# EAGLE design cuk_inverter (EAGLE 8.2.2)
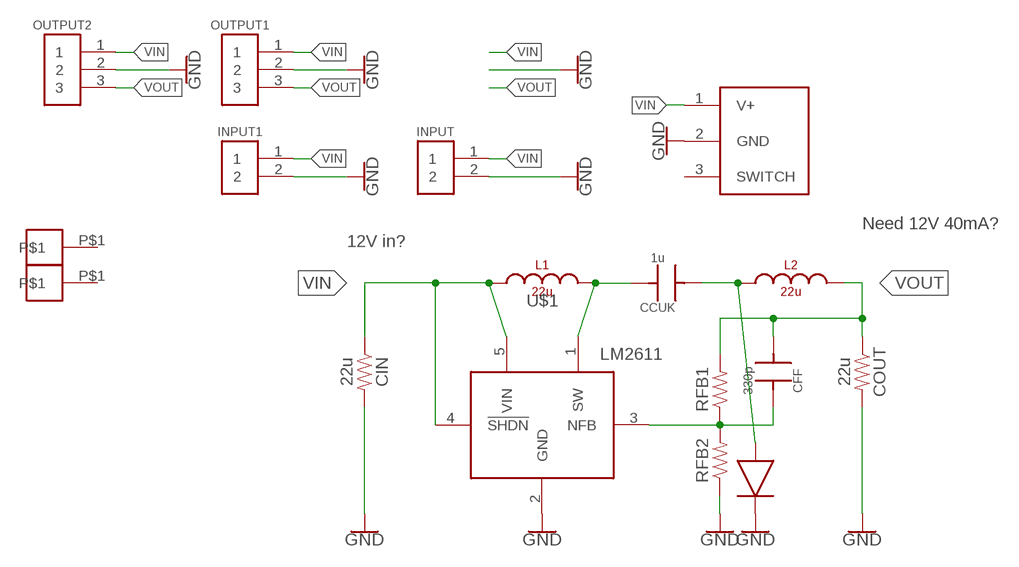
[diagram p0: schematic, sheet 1]

## Parts
CCUK  1u  CAP805B  [0805_B]
CFF  330p  CAP805B  [0805_B]
CIN  22u  RESISTOR1206  [1206]
COUT  22u  RESISTOR1206  [1206]
INPUT  M02  [OSTVN02]
INPUT1  M02  [OSTVN02]
L1  22u  INDUCTORSRU5018  [INDUCTOR_BOURNS_SRU5018]
L2  22u  INDUCTORSRU5018  [INDUCTOR_BOURNS_SRU5018]
OUTPUT1  M03  [OSTVN03]
OUTPUT2  M03  [OSTVN03]
RFB1  RESISTOR0805  [0805]
RFB2  RESISTOR0805  [0805]
U$1  LM2611  [SOT-23]
U$6  FIDUCIAL  [FIDUCIAL_0.5MM]
U$7  FIDUCIAL  [FIDUCIAL_0.5MM]
U$8  DIODE  [STTH3R04U]
V1  POWER_DC_BARREL_JACKCP-102A  [CONN_JACK_POWER_2.1MM_PCB]

## Nets
CUK: CCUK.1 L2.1 U$8.A
FB: CFF.2 RFB1.1 RFB2.2 U$1.3(NFB)
GND: CIN.2 COUT.2 INPUT1.2 INPUT.2 OUTPUT1.2 OUTPUT2.2 RFB2.1 U$1.2(GND) U$8.K V1.2(GND)
SW: CCUK.2 L1.2 U$1.1(SW)
VIN: CIN.1 INPUT1.1 INPUT.1 L1.1 OUTPUT1.1 OUTPUT2.1 U$1.4(!SHDN) U$1.5(VIN) V1.1(V+)
VOUT: CFF.1 COUT.1 L2.2 OUTPUT1.3 OUTPUT2.3 RFB1.2
Unconnected: U$6.P$1 U$7.P$1 V1.3(SWITCH)

## Notes on the sheet
- Need 12V 40mA?
- 12V in?

## Library data of the parts
CCUK CFF = KEMET:CAP
CIN COUT RFB1 RFB2 = Stackpole:RESISTOR: Resistor footprints from the Stackpole datasheets
INPUT INPUT1 = OST:M02
L1 L2 = ERIC:INDUCTOR
OUTPUT1 OUTPUT2 = OST:M03
U$1 = Texas Instruments:LM2611: LM2611 1.4-MHz Cuk Converter http://www.ti.com/lit/ds/symlink/lm2611.pdf
U$6 U$7 = ERIC:FIDUCIAL: For aligning SMD boards, when sometimes required
U$8 = NIXIE:DIODE
V1 = ERIC:POWER_DC_BARREL_JACK

## Board
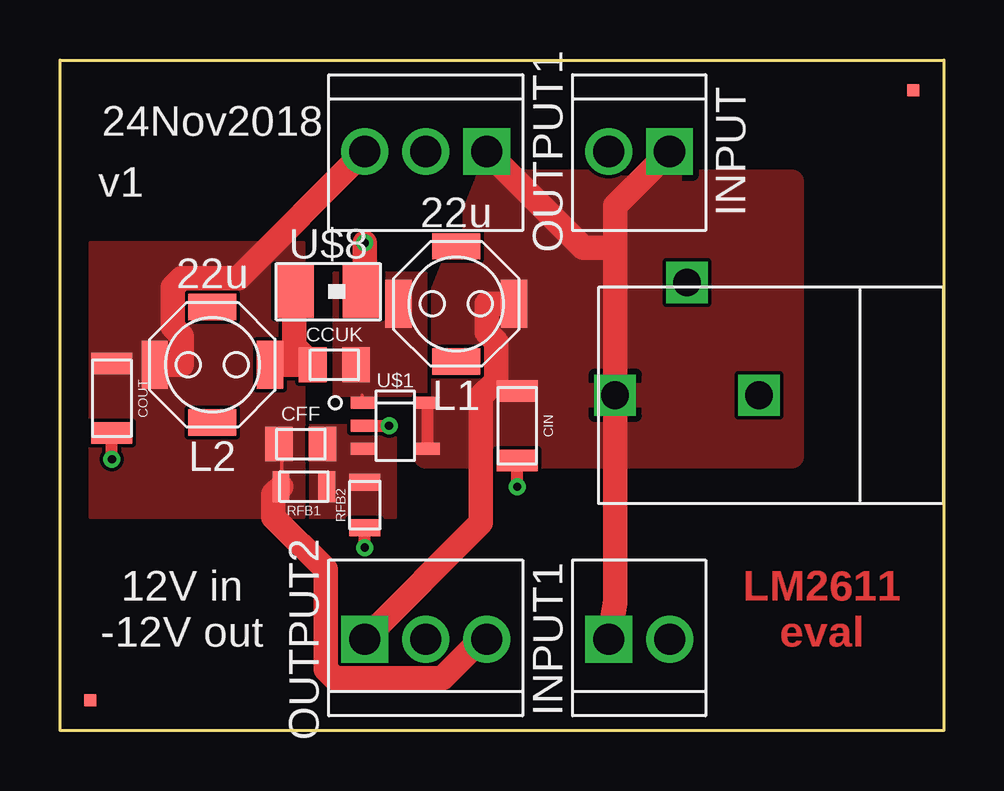
[diagram p1: board, top side]
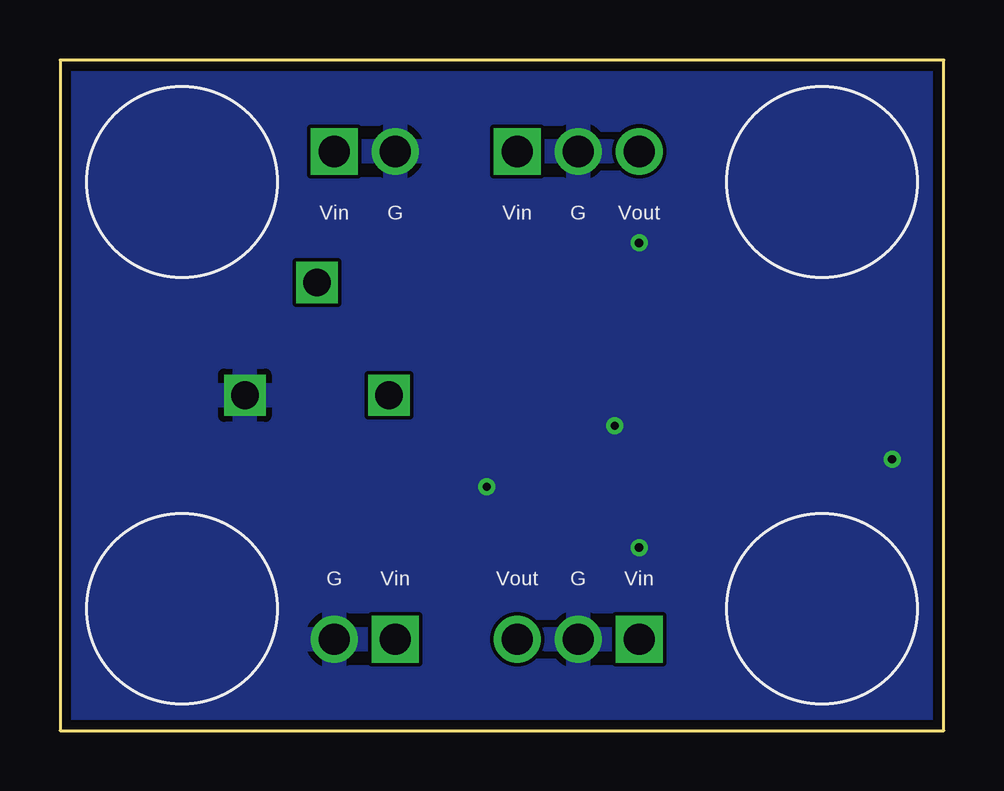
[diagram p2: board, bottom side, seen from below]

Size 36.83 x 27.94 mm. Coordinates in mm from the lower left corner, seen from the top.
Outline: 0,27.94 36.83,27.94 36.83,0 0,0 0,27.94
Copper layers (1*16): Top 0.0356mm / dielectric 1.5011mm / Bottom 0.0356mm
Design rules "oshpark-2layer": minimum track width 6mil, minimum drill 13mil, track to track 6mil, track to pad 6mil, pad to pad 6mil, via to via 6mil, smd to smd 6mil, copper to edge 15mil, drill to drill 6mil, minimum pad ring 7mil, minimum via ring 7mil, stop-mask expansion 2.5mil, vias tented up to drill 0mil, thermal gap 10mil

### Footprints (pad centres in the part's own frame; a part is rotated, then mirrored left to right if it is on the bottom)
0805_B = smd 1.15 x 1.45: 1 -0.9,0; 2 0.9,0
1206 = smd 0.9 x 1.7: 1 -1.45,0; 2 1.45,0
OSTVN02 = drill 1.3 square: 1 -2.54,0 | drill 1.3: 2 0,0
INDUCTOR_BOURNS_SRU5018 = smd 1.1 x 2: 1 -2.4,0; 2 2.4,0 | smd 2 x 1.1: 3 0,2.4; 4 0,-2.4
OSTVN03 = drill 1.3 square: 1 -2.54,0 | drill 1.3: 2 0,0; 3 2.54,0
0805 = smd 0.7 x 1.3: 1 -0.95,0; 2 0.95,0
SOT-23 = smd 1 x 0.5: 1 -1.35,0.95; 2 -1.35,0; 3 -1.35,-0.95; 4 1.35,-0.95; 5 1.35,0.95
FIDUCIAL_0.5MM = smd 0.5 x 0.5: P$1 0,0
STTH3R04U = smd 1.62 x 2.18: A -1.41,0; K 1.41,0
CONN_JACK_POWER_2.1MM_PCB = drill 1.15 square: 1 0,13.7; 2 0,7.7; 3 4.7,10.7

### Placement (x,y rotation side)
CCUK  11.43,15.24 0 top
CFF  10.03,11.94 0 top
CIN  19.05,12.7 270 top
COUT  2.16,13.84 270 top
INPUT  22.86,24.13 180 top
INPUT1  25.4,3.81 0 top
L1  16.51,17.78 180 top
L2  6.35,15.24 180 top
OUTPUT1  15.24,24.13 180 top
OUTPUT2  15.24,3.81 0 top
RFB1  10.16,10.16 180 top
RFB2  12.7,9.4 90 top
U$1  13.97,12.7 0 top
U$2  [SJ5302]  5.08,22.86 0 bottom
U$3  [SJ5302]  5.08,5.08 0 bottom
U$4  [SJ5302]  31.75,5.08 0 bottom
U$5  [SJ5302]  31.75,22.86 0 bottom
U$6  35.56,26.67 0 top
U$7  1.27,1.27 0 top
U$8  11.18,18.29 0 top
V1  36.83,13.97 90 top

### Tracks (layer width: path | path; a pad name or v marks a point on that pad's centre or on a via)
CUK
  Top 0.152: 10.48,17.46 9.84,18.1 U$8.A | 10.48,15.56 CCUK.1
  Top 1.016: L2.1 CCUK.1 9.77,16 U$8.A
  pour Top (rank 2): 8.89,16.51 10.16,16.51 10.16,13.97 8.89,13.97
FB
  pour Top (rank 2): 10.16,8.89 13.97,8.89 13.97,12.7 10.16,12.7
GND  (via drill 0.35)
  Top 0.508: v2.16,11.3 COUT.2 | v12.7,7.62 RFB2.1 | U$1.2 v13.72,12.7 | v19.05,10.16 CIN.2
  Top 1.016: v12.7,20.32 12.7,18.4 U$8.K
  pour Bottom: -6.35,27.94 40.64,27.94 40.64,-1.27 -7.62,0
SW
  Top 0.152: 12.6,13.97 12.6,13.66 U$1.1
  pour Top: 11.43,13.97 15.24,13.97 15.24,19.05 12.7,19.05 11.43,19.05
VIN
  Top 0.508: U$1.4 U$1.5
  Top 1.016: INPUT1.1 23.13,5.35 V1.1 23.13,20.11 | OUTPUT2.1 17.54,8.65 17.54,13.93 18.17,14.56 18.17,16.2 17.78,16.59 17.78,17.78 L1.1 | INPUT.1 23.13,21.86 23.13,20.11 | OUTPUT1.1 21.8,20.11 23.13,20.11
  pour Top (rank 3): 15.24,11.43 15.24,16.51 17.78,22.86 30.48,22.86 30.48,11.43
VOUT
  Top 0.152: RFB1.2 9.25,10.16 9.25,11.38 CFF.1
  Top 1.016: OUTPUT1.3 7.42,18.85 5.08,18.85 4.69,18.46 4.69,16.82 5.08,16.43 5.08,15.24 L2.2 | OUTPUT2.3 17.55,3.81 15.92,2.17 11.45,2.17 11.07,2.56 11.07,6.72 8.89,8.89 8.89,9.84 RFB1.2
  pour Top: 1.27,20.32 10.16,20.32 10.16,8.89 1.27,8.89

### Text on the board
Top: LM2611 / eval
tPlace: 24Nov2018 | v1 | 12V in / -12V out
bPlace: Vout | G | Vin | G | Vin | Vin | G | Vout | Vin | G
tStop: LM2611 / eval